# Altium schematic sheet 4_SensorsAndComms.SchDoc
size A4
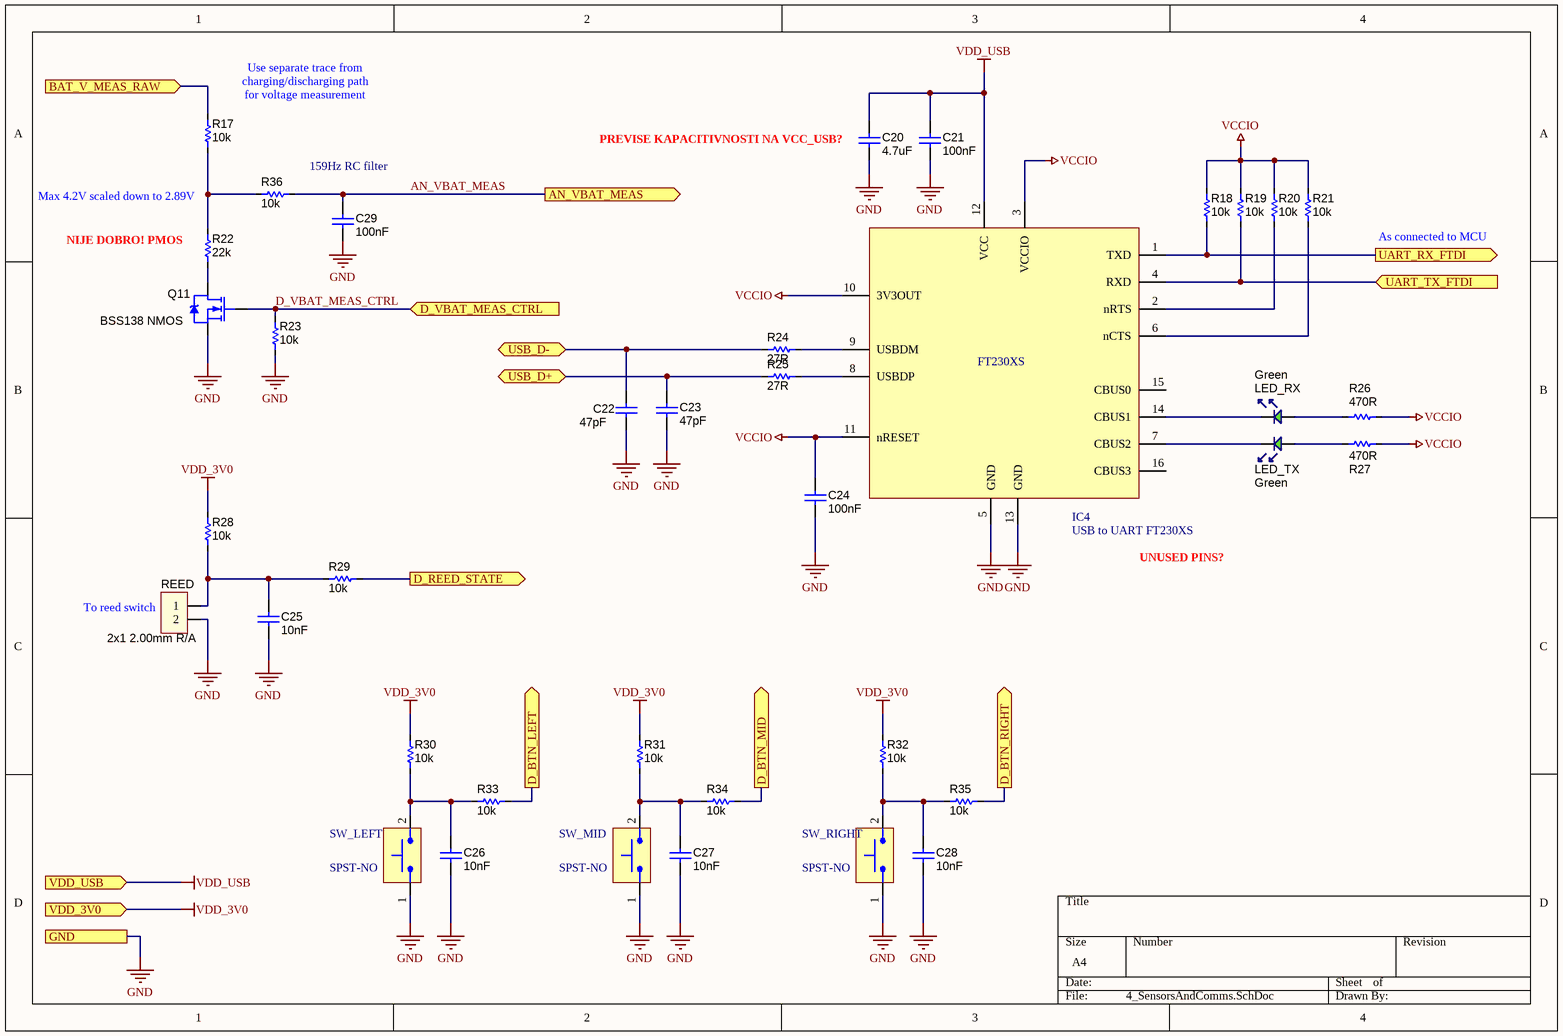
[diagram p0: 4_SensorsAndComms.SchDoc]

## Parts
C20  4.7uF  [CAP_0805]
C21  100nF  [CAP_0603]
C22  47pF  [CAP_0603]
C23  47pF  [CAP_0603]
C24  100nF  [CAP_0603]
C25  10nF  [CAP_0603]
C26  10nF  [CAP_0603]
C27  10nF  [CAP_0603]
C28  10nF  [CAP_0603]
C29  100nF  [CAP_0603]
IC4  USB to UART FT230XS  [SSOP-16 (3.90mm width)]
LED_RX  Green  [LED_0603]
LED_TX  Green  [LED_0603]
Q11  BSS138 NMOS  [SOT-23-3]
R17  10k  [RES_0603]
R18  10k  [RES_0603]
R19  10k  [RES_0603]
R20  10k  [RES_0603]
R21  10k  [RES_0603]
R22  22k  [RES_0603]
R23  10k  [RES_0603]
R24  27R  [RES_0603]
R25  27R  [RES_0603]
R26  470R  [RES_0603]
R27  470R  [RES_0603]
R28  10k  [RES_0603]
R29  10k  [RES_0603]
R30  10k  [RES_0603]
R31  10k  [RES_0603]
R32  10k  [RES_0603]
R33  10k  [RES_0603]
R34  10k  [RES_0603]
R35  10k  [RES_0603]
R36  10k  [RES_0603]
REED  2x1 2.00mm R/A  [JST R/A MALE 2x2.00MM]
SW_LEFT  SPST-NO  [SWITCH_TACTILE_SMD_6X3.5mm_2pin]
SW_MID  SPST-NO  [SWITCH_TACTILE_SMD_6X3.5mm_2pin]
SW_RIGHT  SPST-NO  [SWITCH_TACTILE_SMD_6X3.5mm_2pin]

## Ports
AN_VBAT_MEAS (out), BAT_V_MEAS_RAW (in), D_BTN_LEFT (out), D_BTN_MID (out), D_BTN_RIGHT (out), D_REED_STATE (out), D_VBAT_MEAS_CTRL (in), GND, UART_RX_FTDI (out), UART_TX_FTDI (in), USB_D+ (bidir), USB_D- (bidir), VDD_3V0 (in), VDD_USB (in)

## Nets
GND: C20.2 C21.2 C22.2 C23.2 C24.2 C25.2 C26.2 C27.2 C28.2 C29.2 IC4.5(GND) IC4.13(GND) Q11.2(S) R23.1 REED.2 SW_LEFT.1 SW_MID.1 SW_RIGHT.1 ; port GND
VCCIO: C24.1 IC4.3(VCCIO) IC4.10(3V3OUT) IC4.11(nRESET) R18.2 R19.2 R20.2 R21.2 R26.2 R27.2
VDD_3V0: R28.2 R30.2 R31.2 R32.2 ; port VDD_3V0
VDD_USB: C20.1 C21.1 IC4.12(VCC) ; port VDD_USB
AN_VBAT_MEAS: C29.1 R36.1 ; port AN_VBAT_MEAS
BAT_V_MEAS_RAW: R17.2 ; port BAT_V_MEAS_RAW
D_BTN_LEFT: R33.1 ; port D_BTN_LEFT
D_BTN_MID: R34.1 ; port D_BTN_MID
D_BTN_RIGHT: R35.1 ; port D_BTN_RIGHT
D_REED_STATE: R29.1 ; port D_REED_STATE
D_VBAT_MEAS_CTRL: Q11.1(G) R23.2 ; port D_VBAT_MEAS_CTRL
UART_RX_FTDI: IC4.1(TXD) R18.1 ; port UART_RX_FTDI
UART_TX_FTDI: IC4.4(RXD) R19.1 ; port UART_TX_FTDI
USB_D+: C23.1 R25.1 ; port USB_D+
USB_D-: C22.1 R24.1 ; port USB_D-
NetC25_1: C25.1 R28.1 R29.2 REED.1
NetC26_1: C26.1 R30.1 R33.2 SW_LEFT.2
NetC27_1: C27.1 R31.1 R34.2 SW_MID.2
NetC28_1: C28.1 R32.1 R35.2 SW_RIGHT.2
NetIC4_2: IC4.2(nRTS) R20.1
NetIC4_6: IC4.6(nCTS) R21.1
NetIC4_7: IC4.7(CBUS2) LED_TX.K
NetIC4_8: IC4.8(USBDP) R25.2
NetIC4_9: IC4.9(USBDM) R24.2
NetIC4_14: IC4.14(CBUS1) LED_RX.K
NetLED_RX_A: LED_RX.A R26.1
NetLED_TX_A: LED_TX.A R27.1
NetQ11_3: Q11.3(D) R22.1
NetR17_1: R17.1 R22.2 R36.2

Not connected (* = marked no-connect by the designer): IC4 15(CBUS0) 16(CBUS3)

## Notes on the sheet
- (near R17) Use separate trace from charging/discharging path for voltage measurement
- 159Hz RC filter
- PREVISE KAPACITIVNOSTI NA VCC_USB?
- Max 4.2V scaled down to 2.89V
- NIJE DOBRO! PMOS
- As connected to MCU
- UNUSED PINS?
- (near REED) To reed switch
- (in symbol IC_USB_SERIAL_UART_FT230XS-R_16-SSOP) FT230XS

## Library data of the parts
C20 = CAP_4.7uF_25V_0805: Cermacic Capacitor 0805 25V 4.7uF; Manufacturer: n/a; Manufacturer Part Number: n/a; Supplier: Kelco; Supplier Part Number: 20226; Package: 0805; Capacitance: 4.7uF; Voltage Rating: 25v; Tolerance: n/a; Dielectric class: n/a
C21 C24 C29 = CAP_100nF_50V_0603: Cermacic Capacitor 0603 50V 100nF; Dielectric class: X7R; Manufacturer: n/a; Manufacturer Part Number: n/a; Supplier: Kelco; Supplier Part Number: 11061; Package: 0603; Capacitance: 100nF; Voltage Rating: 50V; Tolerance: n/a
C22 C23 = CAP_47pF_50V_0603: Ceramic Capacitor 0603 50V 47pF NPO; Manufacturer: n/a; Manufacturer Part Number: n/a; Supplier: Kelco; Supplier Part Number: 12902; Package: 0603; Capacitance: 47pF; Voltage Rating: 50V; Tolerance: n/a; Dielectric class: NPO
C25-C28 = CAP_10nF_63V_X7R_0603: Cermacic Capacitor 0603 16V 10nF; Voltage Rating: 63V; Dielectric class: X7R; Manufacturer: n/a; Manufacturer Part Number: n/a; Supplier: Kelco; Supplier Part Number: 11586; Package: 0603; Capacitance: 10nF; Tolerance: n/a
IC4 = IC_USB_SERIAL_UART_FT230XS-R_16-SSOP: USB 2.0 to UART interface; Manufacturer: FTDI; Supply Voltage: 3V3~5V (1V8 ~ 3V3 VCCIO); Quiescent Current: 125uA; Manufacturer Part Number: FT230XS-R; Supplier: Digikey; Supplier Part Number: 768-1135-1-ND; Package: 16-SSOP (3.90mm width); Value: USB to UART FT230XS; Operating Temperature: -40°C ~ +85°C; ComponentLink1Description: Datasheet; ComponentLink1URL: https://ftdichip.com/wp-content/uploads/2021/10/DS_FT230X.pdf
LED_RX LED_TX = LED_Green_3V_20mA_0603: LED Diode SMD Green; Forward Voltage: 3V; Forward Current: 20mA; Intensity: 120mCd; Angle of Visibility: 120deg; Manufacturer: n/a; Manufacturer Part Number: n/a; Supplier: Kelco; Supplier Part Number: 18013; Color: Green; Package: 0603
Q11 = MOSFET_N_60V_220mA_BSS138_SOT-23: MOSFET N-channel SMD BSS138 220mA 50V; Manufacturer: ONsemi; VGSmax: 20V; VDSmax: 60V; IDmax (pulse): 880mA; RDSon: 1Ohm; Transconductance gfs: 0.5S; PDmax: 0.35W; Vth: 1.3V; Manufacturer Part Number: BSS138; Supplier: Kelco; Supplier Part Number: 19727; Value: BSS138 NMOS; Package: SOT-23-3; IDmax: 220mA; ComponentLink1Description: Datasheet; ComponentLink1URL: https://www.onsemi.com/pdf/datasheet/nds7002a-d.pdf
R17-R21 R23 R28-R36 = RES_10k_1%_0.1W_0603: Resistor SMD 0603 10k 0.1W 1%; Manufacturer: n/a; Manufacturer Part Number: n/a; Supplier: Kelco; Supplier Part Number: 11702; Resistance: 10k; Package: 0603; Power Rating: 0.1W; Tolerance: 1%
R22 = RES_22k_1%_0.1W_0603: Resistor SMD 0603 22k 0.1W 1%; Manufacturer: n/a; Manufacturer Part Number: n/a; Supplier: Kelco; Supplier Part Number: 13741; Resistance: 22k; Package: 0603; Power Rating: 0.1W; Tolerance: 1%
R24 R25 = RES_27R_1%_0.1W_0603: Resistor SMD 0603 27R 0.1W 1%; Manufacturer: n/a; Manufacturer Part Number: n/a; Supplier: Kelco; Supplier Part Number: 14163; Resistance: 27R; Package: 0603; Power Rating: 0.1W; Tolerance: 1%
R26 R27 = RES_470R_1%_0.1W_0603: Resistor SMD 0603 0R 0.1W 1%; Manufacturer: n/a; Manufacturer Part Number: n/a; Supplier: Kelco; Supplier Part Number: 8983; Resistance: 470R; Package: 0603; Power Rating: 0.1W; Tolerance: 1%
REED = CONN_JST_TH_R/A_2x1M_2.0mm: Connector JST-PH through-hole right angle 2.0mm pitch; Manufacturer: JST Sales America Inc.; Manufacturer Part Number: S2B-PH-K-S; Mating Part Number: PHR-2; Supplier: Kelco; Supplier Part Number: 16232; Value: 2x1 2.00mm R/A
SW_LEFT SW_MID SW_RIGHT = SWITCH_SMD_6X3.5mm_2pin: SMD Tactile switch 2 pin 6x3.5mm SPST-NO 5mm height; Manufacturer: Diptronics; Manufacturer Part Number: DTSM-32N; Rated Voltage: 12V; Rated Current: 50mA; Contact Resistance: 100mOhm; Supplier: Kelco; Supplier Part Number: 15159; Contact form: SPST-NO; ComponentLink1Description: Datasheet; ComponentLink1URL: https://eu.mouser.com/datasheet/2/910/444_DTS-3-1571561.pdf